# Altium schematic sheet FPGA_Interface_BaseBoard V3I1 Project.SchDoc
size A3; CompanyName: FEDEVEL; Organization: FEDEVEL; DocumentNumber: 1; Revision: V1I1; SheetNumber: 1; SheetTotal: 9; PageSetup: Record=PageOptions|CenterHorizontal=True|CenterVertical=True|PrintScale=1.07|XCorrection=1.00|YCorrection=1.00|PrintKind=1|BorderSize=5000000|LeftOffset=0|BottomOffset=0|Orientation=2|PaperLength=1000|PaperWidth=1000|Scale=100|PaperSource=7|PrintQuality=600|MediaType=1|DitherType=10|PaperKind=A3|PrintScaleMode=1; ProjectName: KDS C6A816x Module
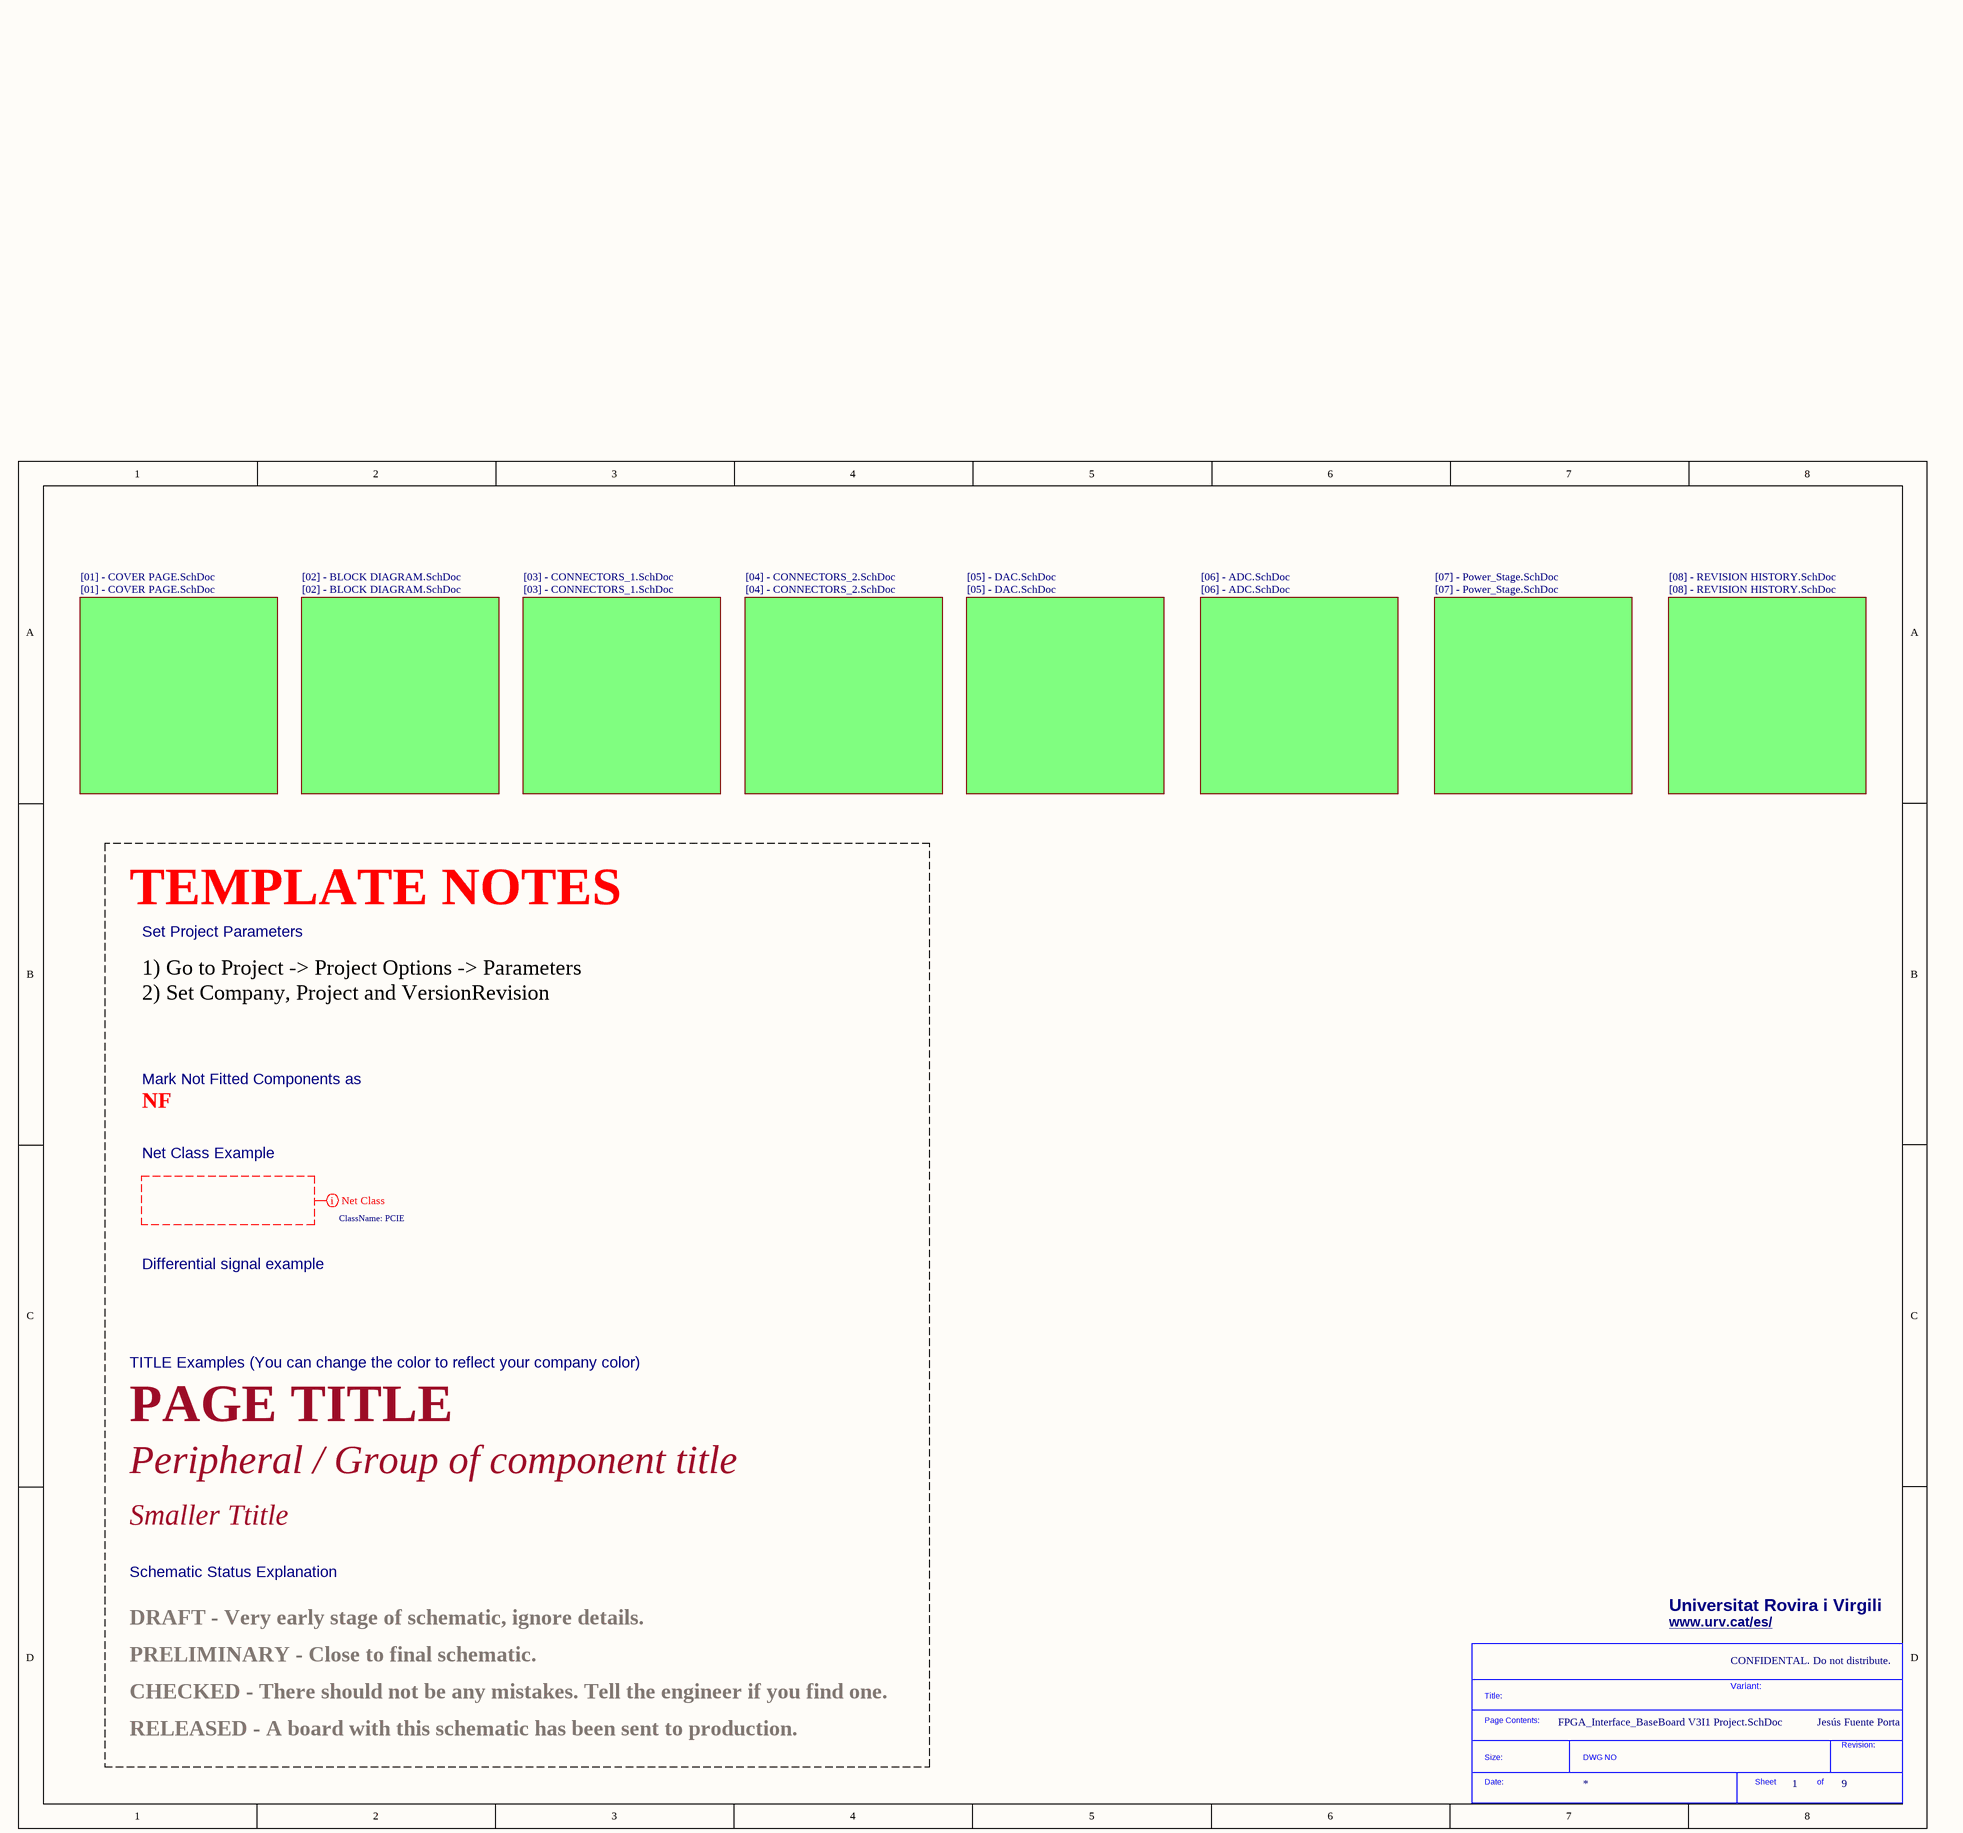
[diagram p0: FPGA_Interface_BaseBoard V3I1 Project.SchDoc]

## Parts
*  SDTitleBlock  (value not drawn)  (graphical)

## Sub-sheets
[01] - COVER PAGE.SchDoc = [01] - COVER PAGE.SchDoc: no entries
[02] - BLOCK DIAGRAM.SchDoc = [02] - BLOCK DIAGRAM.SchDoc: no entries
[03] - CONNECTORS_1.SchDoc = [03] - CONNECTORS_1.SchDoc: no entries
[04] - CONNECTORS_2.SchDoc = [04] - CONNECTORS_2.SchDoc: no entries
[05] - DAC.SchDoc = [05] - DAC.SchDoc: no entries
[06] - ADC.SchDoc = [06] - ADC.SchDoc: no entries
[07] - Power_Stage.SchDoc = [07] - Power_Stage.SchDoc: no entries
[08] - REVISION HISTORY.SchDoc = [08] - REVISION HISTORY.SchDoc: no entries

## Layout directives
net class PCIE: (no net found under the mark)

## Notes on the sheet
- TEMPLATE NOTES
- Set Project Parameters
- 1) Go to Project -> Project Options -> Parameters
  2) Set Company, Project and VersionRevision
- NF
- Mark Not Fitted Components as
- Net Class Example
- Differential signal example
- TITLE Examples (You can change the color to reflect your company color)
- PAGE TITLE
- Peripheral / Group of component title
- Smaller Ttitle
- Schematic Status Explanation
- Universitat Rovira i Virgili
- PRELIMINARY - Close to final schematic.
- DRAFT - Very early stage of schematic, ignore details.
- www.urv.cat/es/ <http://www.urv.cat/es/>
- CONFIDENTAL. Do not distribute.
- CHECKED - There should not be any mistakes. Tell the engineer if you find one.
- Variant:
- Jesús Fuente Porta
- RELEASED - A board with this schematic has been sent to production.
- (in symbol SDTitleBlock) Title:; Page Contents:; Revision:; Size:; DWG NO; Date:; Sheet; of